# Altium schematic sheet MCU.SchDoc
size A4
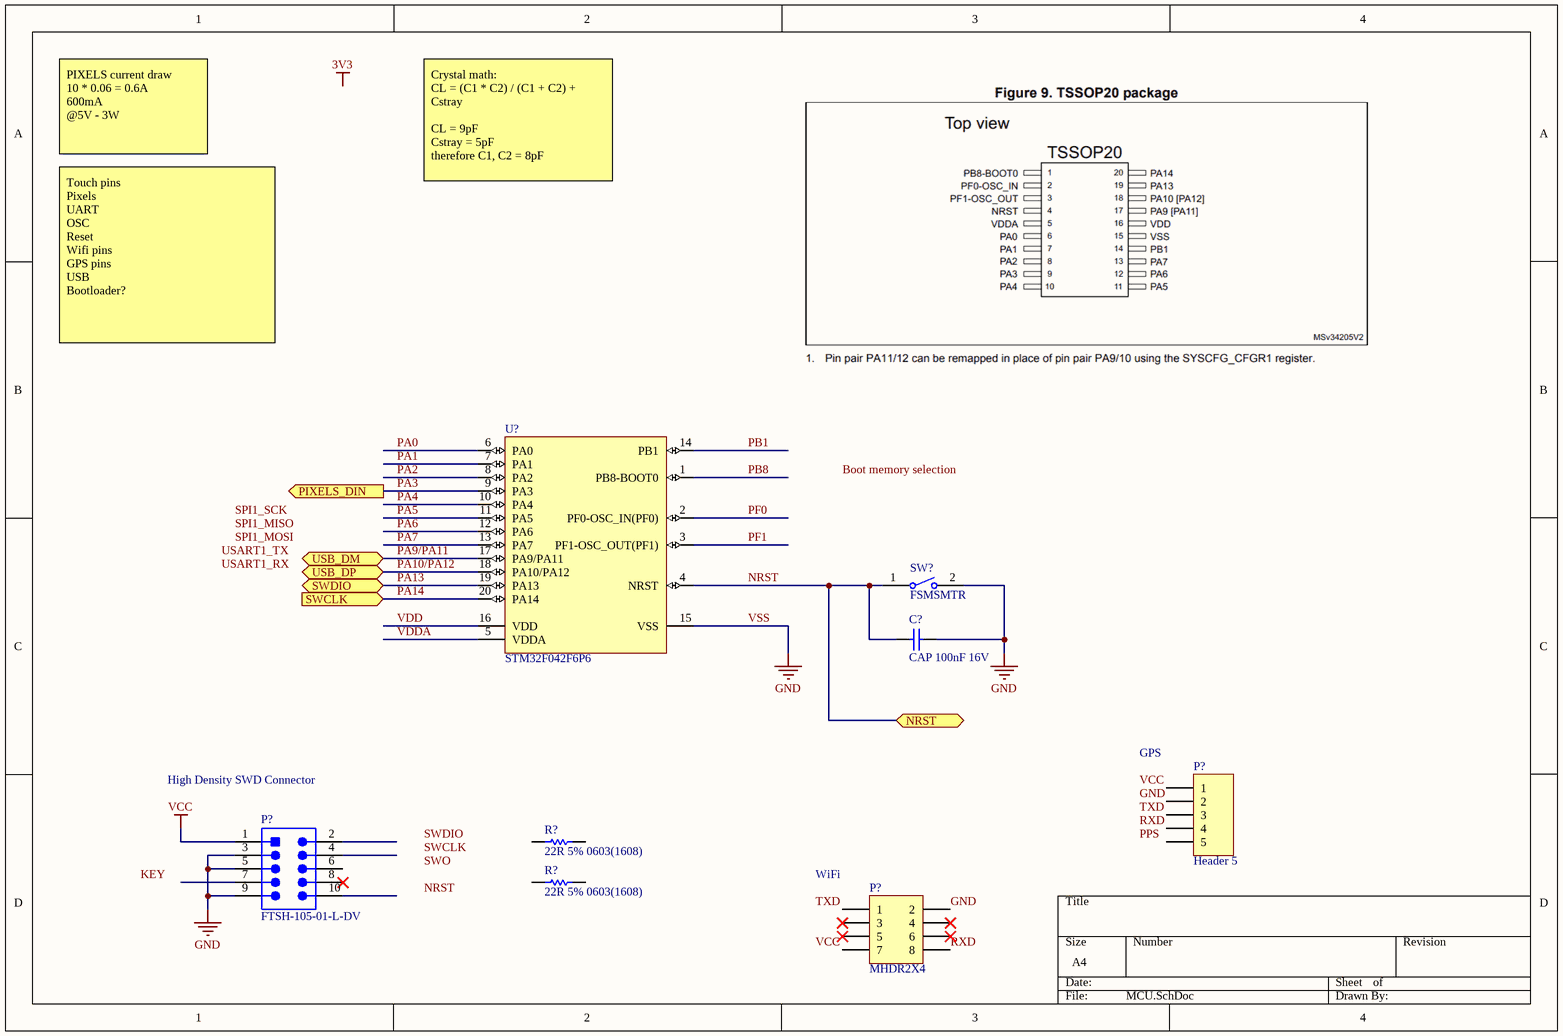
[diagram p0: MCU.SchDoc]

## Parts
(Parts that share a designator on the sheet are numbered #1, #2 ... from top to bottom, then left to right.)
C?  CAP 100nF 16V  [CAPC0603(1608)100_N]
P?#1  Header 5  [HDR1X5]
P?#2  FTSH-105-01-L-DV  [SMTC-FTSH-105-01-L-DV_V]
P?#3  MHDR2X4  [MHDR2X4]
R?#1  22R 5% 0603(1608)  [RESC0603(1608)_N]
R?#2  22R 5% 0603(1608)  [RESC0603(1608)_N]
SW?  FSMSMTR  [TECO-FSMSMTR_V]
U?  STM32F042F6P6  [STM-TSSOP20_M]

## Ports
NRST (bidir), PIXELS_DIN (out), SWCLK (in), SWDIO (bidir), USB_DM (bidir), USB_DP (bidir)

## Nets
GND: C?.2 P?#2.3 P?#2.5 P?#2.9 P?#3.2 SW?.2 U?.15(VSS)  [also labelled VSS]
VCC: P?#2.1
NRST: C?.1 SW?.1 U?.4(NRST) ; port NRST
PA0: U?.6(PA0)
PA1: U?.7(PA1)
PA2: U?.8(PA2)
PA3: U?.9(PA3) ; port PIXELS_DIN
PA4: U?.10(PA4)
PA5: U?.11(PA5)
PA6: U?.12(PA6)
PA7: U?.13(PA7)
PA9/PA11: U?.17(PA9/PA11) ; port USB_DM
PA10/PA12: U?.18(PA10/PA12) ; port USB_DP
PA13: U?.19(PA13) ; port SWDIO
PA14: U?.20(PA14) ; port SWCLK
PB1: U?.14(PB1)
PB8: U?.1(PB8-BOOT0)
PF0: U?.2(PF0-OSC_IN(PF0))
PF1: U?.3(PF1-OSC_OUT(PF1))
RXD: P?#3.8
VDD: U?.16(VDD)
VDDA: U?.5(VDDA)

Not connected (* = marked no-connect by the designer): P?#1 1 2 3 4 5; P?#2 2 4 6 7 8* 10; P?#3 1 3* 4* 5* 6* 7; R?#1 1 2; R?#2 1 2

## Notes on the sheet
- PIXELS current draw
  10 * 0.06 = 0.6A
  600mA
  @5V - 3W
- Crystal math:
  CL = (C1 * C2) / (C1 + C2) + Cstray
  CL = 9pF
  Cstray = 5pF
  therefore C1, C2 = 8pF
- Touch pins
  Pixels
  UART
  OSC
  Reset
  Wifi pins
  GPS pins
  USB
  Bootloader?
- High Density SWD Connector
- (near P?#1) GPS
- (near P?#3) WiFi
- Labels drawn without touching a wire or pin: 3V3, Boot memory selection, GND, KEY, NRST, PPS, RXD, SPI1_MISO, SPI1_MOSI, SPI1_SCK, SWCLK, SWDIO, SWO, TXD, USART1_RX, USART1_TX, VCC

## Library data of the parts
C? = CMP-1035-02584-1: CAP 100nF 16V ±10% 0603 (1608 Metric) Thickness 1mm SMD; Tolerance: Â±10%; Case-EIA: 0603; Case-Metric: 1608; Technology: SMT; Max Thickness: 1 mm; Value: 100nF; Rated Voltage: 16 V
P?#1 = Header 5: Header, 5-Pin; LatestRevisionDate: 17-Jul-2002; LatestRevisionNote: Re-released for DXP Platform.; Publisher: Altium Limited
P?#2 = CMP-2000-05354-1: Male Header, Pitch 1.27 mm, 2 x 5 Position, Height 5.96 mm, -55 to 125 degC, RoHS, Bulk; Manufacturer: Samtec; Connector Type: Header,Unshrouded; Pitch: 0.050"(1.27mm); Mating Products: FLE-105-01-G-DV-TR-ND-CONNSKT1.27MM10POSDUALSMDCLP-105-02-G-D-P-TR-ND-CONNRCPT10POSDUAL.05"SMDSFMC-105-L2-S-D-TR-ND-CONN.05"SURFACE10POSSMTSFMH-105-02-L-D-TR-ND-CONNRECEPT10POS.50"SMTFLE-105-01-G-DV-A-ND-CONNSKT1.27MM10POSDUALSMDCLP-105-02-G-D-BE-ND-CONNRCPT10POSDUAL.05"SMDFLE-105-01-G-DV-A-P-ND-CONNSKT1.27MM10POSDUALSMDSAM1153-05-ND-CONNRCPT10POSDUAL.05"SMDSAM1155-05-ND-CONNRCPT10POSDUAL.05"SMDSAM1154-05-ND-CONNRCPT10POSDUAL.05"SMDSFMH-105-02-L-D-LC-ND-CONNRECEPT10POS.50"SMTSAM1226-05-ND-CONNRCPT.05"10POSDUALSMD; Catalog Drawings: FTSHSeriesFTSHSeriesSMTSide; Other Names: SAM1161-05; EDA / CAD Models: DownloadfromAcceleratedDesigns; Number of Positions Loaded: All; Number of Positions: 10; Featured Product: Board-To-BoardInterconnectSystems; Online Catalog: FTSHSeries; Product Training Modules: Board-to-BoardConnectors; Category: Connectors,Interconnects; Number of Rows: 2; Contact Finish: Gold; Termination: Solder; Mounting Type: SurfaceMount; Series: FTSH; Contact Mating Length: 0.120"(3.05mm); Row Spacing: 0.050"(1.27mm); Datasheet URL: https://datasheet.ciiva.com/30493/0900766b80adfe36-30493006.pdf; Contact Finish Thickness: 10µin(0.25µm); Features: -; Standard Package: 1; Packaging: Bulk; Datasheet Version: Feb-08; Manufacturer URL: http://www.samtec.com/; Fastening Type: -; Family: RectangularConnectors-Headers,MalePins; Contact Type: MalePin; Color: Black
P?#3 = MHDR2X4: Header, 4-Pin, Dual row; LatestRevisionDate: 17-Jul-2002; LatestRevisionNote: Re-released for DXP Platform.; Publisher: Altium Limited
R?#1 R?#2 = CMP-1012-00034-1: 22R 0.1W 5% 0603 (1608 Metric)  SMD; Value: 22.00 Ohm; Case-EIA: 0603; Case-Metric: 1608; Technology: SMT; Power: 0.1 W; Tolerance: 5 %
SW? = CMP-2000-07501-1: FSMSM Push Button Switch, 50 mA, -35 to 85 degC, 2-Pin SMD, RoHS, Tape and Reel; Manufacturer: TE Connectivity; Voltage Rating (DC): 24V; Electrical Life: 20000Cycles; Operating Force: 180gf; Switch Travel: 0.25mm; Contact Current Rating: 50mA; Case\/Package: SMD/SMT; Actuator Length: 1.07mm; Throw Configuration: SPST; Actuator Material: Polyamide; Contact Resistance: 100mOhm; Illumination Type: Illuminated; Max Voltage Rating (DC): 12V; Manufacturer URL: http://www.te.com/; Lead Free: LeadFree; Packaging: TapeandReel; Min Operating Temperature: -35degC; Mechanical Life: 20000Cycles; Mount: SurfaceMount; REACH SVHC: Unknown; Package Quantity: 1800; Package Reference: FSMSMTR; RoHSCompliant: true; Max Operating Temperature: 85degC; Orientation: Straight; ELV: Compliant; Datasheet URL: http://www.te.com/commerce/DocumentDelivery/DDEController?Action=showdoc&DocId=Customer+Drawing%7F1437566-3%7FC2%7Fpdf%7FEnglish%7FENG_CD_1437566-3_C2_1437566_3_1_c.dwg.pdf%7F1437566-4; Package Description: 2-Pin Surface Mount Device, Body 6 x 3.5 mm, Pitch 9.19 mm; Current Rating: 50mA; Contact Plating: Silver; Termination: GullWing; Datasheet Version: Rev. C2, 08/2014; Contact Material: Brass; Mounting Technology: SurfaceMount
U? = CMP-0304-00108-2: ARM Cortex-M0 32-bit MCU, 32 KB Flash, 6 KB Internal RAM, 16 I/Os, 20-Pin TSSOP, -40 to 85 degC, Tube; Manufacturer: STMicroelectronics; Package Description: 20-Pin Thin Shrink Small Outline Package, Body 6.5 x 4.4 mm, Pitch 0.65 mm; ComponentLink1URL: http://www.st.com/; ComponentLink2Description: Datasheet; Package Reference: TSSOP20; ComponentLink2URL: http://www.st.com/st-web-ui/static/active/en/resource/technical/document/datasheet/DM00105814.pdf; ComponentLink1Description: Manufacturer URL; Mounting Technology: Surface Mount; Core: ARM Cortex-M0; PartNumber: STM32F042F6P6; DatasheetVersion: Rev. 5